# EAGLE design ece_411_team9_bird_feeder (EAGLE 9.6.2)
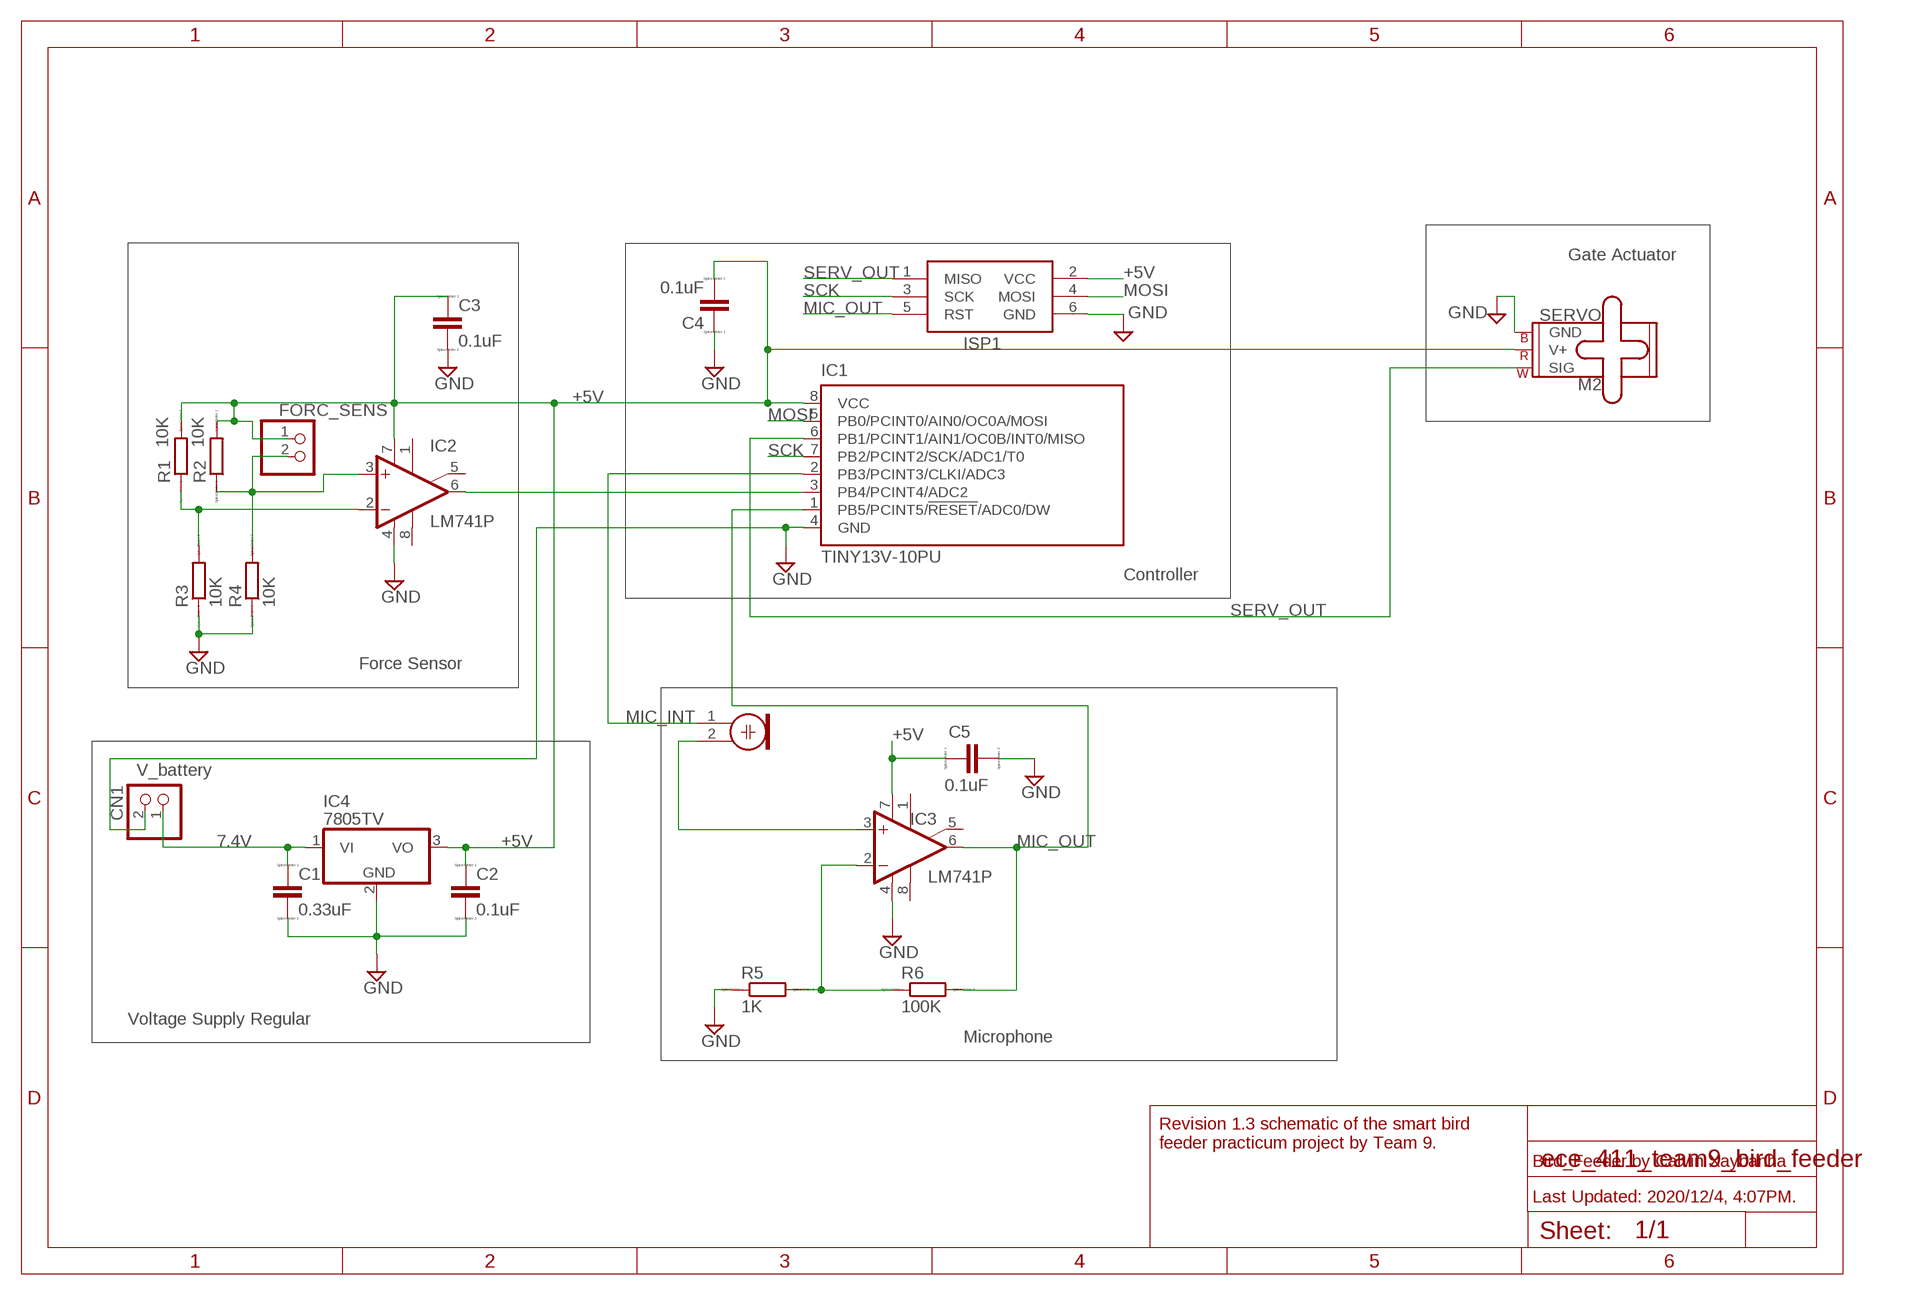
[diagram p0: schematic, sheet 1]

## Parts
C1  0.33uF  C  [C0805]
C2  0.1uF  C  [C0805]
C3  0.1uF  C  [C0805]
C4  0.1uF  C  [C0805]
C5  0.1uF  C  [C0805]
CN1  V_battery  JST_2PIN-SMT  [JST-PH-2-SMT]
FORC_SENS  PINHD-1X2/90  [1X02/90]
IC1  TINY13V-10PU  [DIL08]
IC2  LM741P  [DIL08]
IC3  LM741P  [DIL08]
IC4  7805TV  [TO220V]
ISP1  AVRISP-6  [AVRISP]
M1  ELECTRET_MICROPHON-WM.64PN  [WM-64PN]
M2  SERVO  [1X03]
R1  10K  R  [R0805]
R2  10K  R  [R0805]
R3  10K  R  [R0805]
R4  10K  R  [R0805]
R5  1K  R  [R0805]
R6  100K  R  [R0805]

## Nets
7.4V: C1.1 CN1.1 IC4.1(VI)
+5V [Power]: C2.1 C3.1 C4.2 C5.1 FORC_SENS.1 IC1.8(VCC) IC2.7(V+) IC3.7(V+) IC4.3(VO) ISP1.2(VCC) M2.2(V+) R1.2 R2.2
FSNS_OP2 [Signals]: IC2.2(-IN) R1.1 R3.2
FSNS_OP3 [Signals]: FORC_SENS.2 IC2.3(+IN) R2.1 R4.2
FSNS_OUT [Signals]: IC1.3(PB4/PCINT4/ADC2) IC2.6(OUT)
GND: C1.2 C2.2 C3.2 C4.1 C5.2 CN1.2 IC1.4(GND) IC2.4(V-) IC3.4(V-) IC4.2(GND) ISP1.6(GND) M2.3(GND) R3.1 R4.1 R5.1
MIC_INT [Signals]: IC1.2(PB3/PCINT3/CLKI/ADC3) M1.1
MIC_OP2 [Signals]: IC3.2(-IN) R5.2 R6.1
MIC_OP3 [Signals]: IC3.3(+IN) M1.2
MIC_OUT [Signals]: IC1.1(PB5/PCINT5/!RESET!/ADC0/DW) IC3.6(OUT) ISP1.5(RST) R6.2
MOSI: IC1.5(PB0/PCINT0/AIN0/OC0A/MOSI) ISP1.4(MOSI)
SCK: IC1.7(PB2/PCINT2/SCK/ADC1/T0) ISP1.3(SCK)
SERV_OUT [Signals]: IC1.6(PB1/PCINT1/AIN1/OC0B/INT0/MISO) ISP1.1(MISO) M2.1(SIG)
Unconnected: IC2.1(ON1) IC2.5(ON2) IC2.8(OPT) IC3.1(ON1) IC3.5(ON2) IC3.8(OPT)

## Notes on the sheet
- Gate Actuator
- Controller
- Force Sensor
- Voltage Supply Regular
- Microphone
- Revision 1.3 schematic of the smart bird
  feeder practicum project by Team 9.
- Bird_Feeder by Calvin Xaybanha
- Last Updated: 2020/12/4, 4:07PM.

## Library data of the parts
C1-C5 = eagle-ltspice:C: CAPACITOR, European symbol; SPICEMODEL: NONE; SPICEPREFIX: C
CN1 = adafruit:JST_2PIN: JST 2-Pin Connectors of various flavors SMT-RA (S2B-PH-SM4) 4UConnector #17311 SMT (B2B-PH-SM4) THM-RA (S2B-PH) THM (B2B-PH)
FORC_SENS = pinhead:PINHD-1X2: PIN HEADER
IC1 = atmel:TINY13: 8-bit AVR Microcontroller with 1K Bytes In-System Programmable Flash Source: http://www.atmel.com/dyn/resources/prod_documents/2535S.pdf; MPN: ATTINY13V-10PU; OC_FARNELL: 9171576; OC_NEWARK: 96K6523
IC2 IC3 = linear:*741: OP AMP
IC4 = linear:78*: Positive VOLTAGE REGULATOR Source: http://cache.national.com/ds/LM/LM78L05.pdf http://www.fairchildsemi.com/ds/LM/LM7805.pdf
ISP1 = adafruit:AVRISP: AVR ISP HEADER Standard 6 pin header for AVR programming
M1 = microphon:ELECTRET_MICROPHON-: Electret Condenser Microphone
M2 = SparkFun-Electromechanical:SERVO: Servo Motor 3-pin connector for a standard servo motor (voltage supply, ground, and control signal.) SparkFun Products Servo - Generic (Sub-Micro Size) <https://www.sparkfun.com/products/9065> (ROB-09065) Servo - Generic High Torque Continuous Rotation (Standard Size) <https://www.sparkfun.com/products/9347> (ROB-09347) Servo - Generic High Torque (Standard Size) <https://www.sparkfun.com/products/11965> (ROB-11965)
R1-R6 = eagle-ltspice:R: RESISTOR, European symbol; SPICEMODEL: NONE; SPICEPREFIX: R

## Module CONTROLLER
Ports: 

### Library data of the parts

## Net classes
0 default: width 0.305 mm
1 Power: width 1.27 mm
2 Signals: width 0.305 mm

## Board
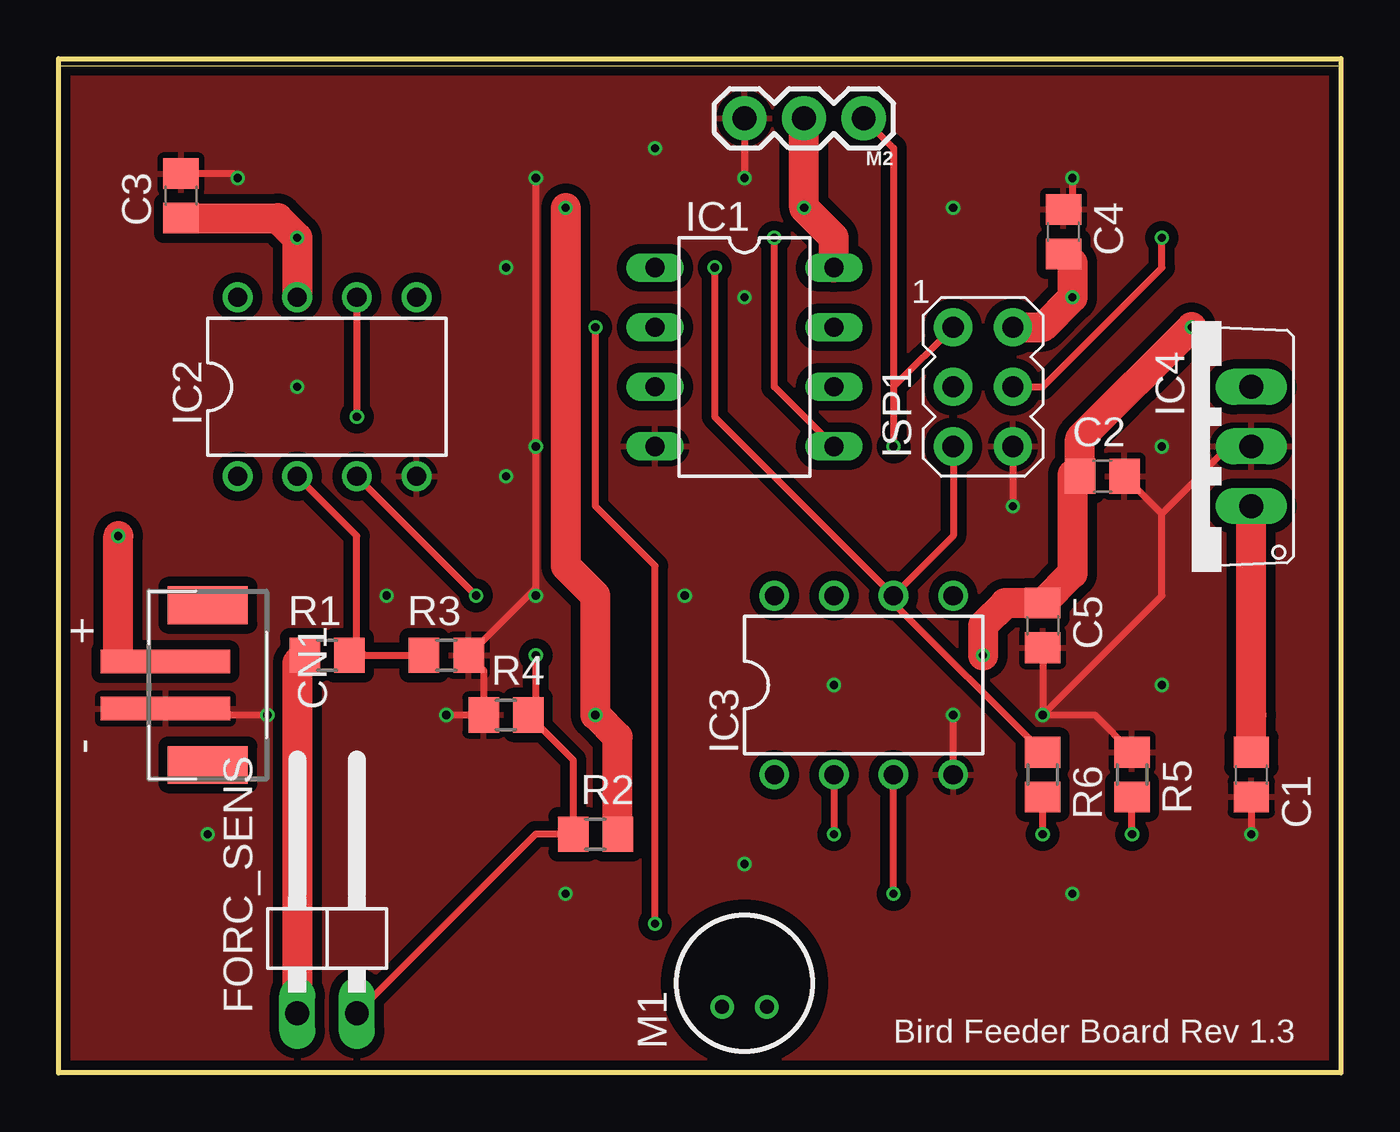
[diagram p1: board, top side]
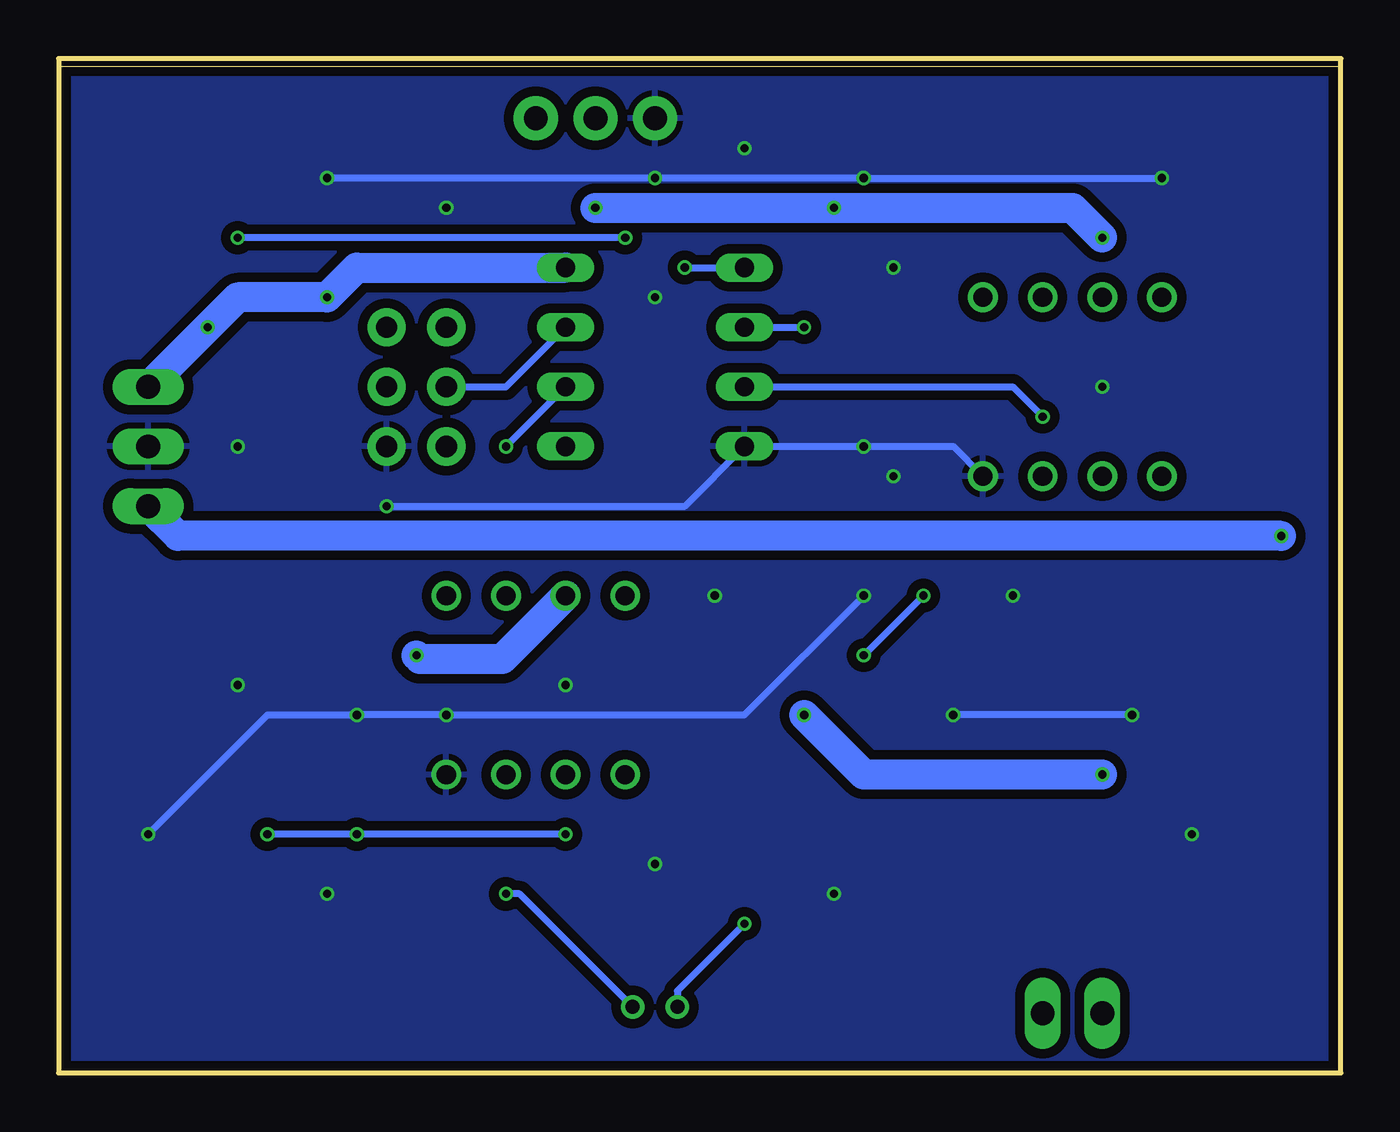
[diagram p2: board, bottom side, seen from below]

Size 54.61 x 43.18 mm. Coordinates in mm from the lower left corner, seen from the top.
Outline: 54.61,0 54.59,0 54.59,42.85 0,42.85 0,43.18
Outline: 0,43.18 0,0 54.61,0
Outline: 0,43.18 54.61,43.18 54.61,0
Copper layers (1*16): Top 0.035559375mm / dielectric 1.6mm / Bottom 0.035559375mm
Design rules "oshpark-2layer": minimum track width 6mil, minimum drill 10mil, track to track 6mil, track to pad 6mil, pad to pad 6mil, via to via 6mil, smd to smd 6mil, copper to edge 15mil, drill to drill 6mil, minimum pad ring 5mil, minimum via ring 5mil, stop-mask expansion 2.5mil, vias tented up to drill 0mil, thermal gap 10mil

### Footprints (pad centres in the part's own frame; a part is rotated, then mirrored left to right if it is on the bottom)
C0805 = smd 1.3 x 1.5: 1 -0.95,0; 2 0.95,0
JST-PH-2-SMT = smd 1 x 5.5: 1 -1,-1.8; 2 1,-1.8 | smd 1.6 x 3.4: NC1 -3.4,0; NC2 3.4,0
1X02/90 = drill 1.016 long: 1 -1.27,-3.81; 2 1.27,-3.81
DIL08 = drill 0.813 long: 1 -3.81,-3.81; 2 -1.27,-3.81; 3 1.27,-3.81; 4 3.81,-3.81; 5 3.81,3.81; 6 1.27,3.81; 7 -1.27,3.81; 8 -3.81,3.81
DIL08' = drill 0.813 pad 1.27: 1 -3.81,-3.81; 2 -1.27,-3.81; 3 1.27,-3.81; 4 3.81,-3.81; 5 3.81,3.81; 6 1.27,3.81; 7 -1.27,3.81; 8 -3.81,3.81
TO220V = drill 1.016 long: 1 -2.54,-2.54; 2 0,-2.54; 3 2.54,-2.54
AVRISP = drill 0.9 pad 1.626: 1 -1.27,2.54; 2 1.27,2.54; 3 -1.27,0; 4 1.27,0; 5 -1.27,-2.54; 6 1.27,-2.54
WM-64PN = drill 0.6 pad 1: 1 -1,0.95; 2 -1,-0.95
1X03 = drill 1.016 pad 1.88: 1 0,0; 2 2.54,0; 3 5.08,0
R0805 = smd 1.3 x 1.5: 1 -0.95,0; 2 0.95,0

### Placement (x,y rotation side)
C1  50.8,12.7 270 top
C2  44.45,25.4 0 top
C3  5.21,37.34 90 top
C4  42.8,35.81 270 top
C5  41.91,19.05 270 top
CN1  6.35,16.51 270 top
FORC_SENS  11.43,6.35 0 top
IC1  29.21,30.48 270 top
IC2  LM741P  [DIL08']  11.43,29.21 0 top
IC3  LM741P  [DIL08']  34.29,16.51 0 top
IC4  48.26,26.67 90 top
ISP1  39.37,29.21 0 top
M1  29.21,3.81 90 top
M2  34.29,40.64 180 top
R1  11.43,17.78 180 top
R2  22.86,10.16 0 top
R3  16.51,17.78 180 top
R4  19.05,15.24 0 top
R5  45.72,12.7 270 top
R6  41.91,12.7 90 top

### Tracks (layer width: path | path; a pad name or v marks a point on that pad's centre or on a via)
7.4V  (via drill 0.35)
  Top 0.305: CN1.1 2.81,17.51 2.54,17.78
  Top 1.27: 2.54,17.78 v2.54,22.86 | C1.1 50.8,15.24 IC4.1
  Bottom 1.27: IC4.1 49.53,22.86 v2.54,22.86
+5V  (via drill 0.35)
  Top 1.27: C4.2 43.18,34.48 v43.18,33.02 41.91,31.75 ISP1.2 | v21.59,36.83 21.59,21.59 22.86,20.32 v22.86,15.24 23.81,14.29 R2.2 | R1.2 10.16,17.46 v10.16,12.7 FORC_SENS.1 | v39.37,17.78 39.37,19.05 40.32,20 C5.1 43.18,21.27 43.18,25.48 C2.1 43.5,26.99 v48.26,31.75 | C3.1 9.33,36.39 v10.16,35.56 IC2.7 | M2.2 v31.75,36.83 33.02,35.56 IC1.8
  Bottom 1.27: v31.75,36.83 v21.59,36.83 11.43,36.83 v10.16,35.56 | v39.37,17.78 39.22,17.63 35.71,17.63 IC3.7 | IC1.8 41.91,34.29 v43.18,33.02 46.99,33.02 v48.26,31.75 IC4.3 | v10.16,12.7 20.32,12.7 v22.86,15.24
FSNS_OP2
  Top 0.305: IC2.2 12.7,22.86 12.7,18.1 | 12.7,18.1 13.02,17.78 R3.2 | R1.1 12.7,18.1
FSNS_OP3  (via drill 0.35)
  Top 0.305: IC2.3 v17.78,20.32 | v20.32,17.78 20.32,15.56 R4.2 21.91,13.33 R2.1 20.32,10.16 FORC_SENS.2
  Bottom 0.305: v17.78,20.32 v20.32,17.78
FSNS_OUT  (via drill 0.35)
  Top 0.305: IC2.6 v12.7,27.94
  Bottom 0.305: IC1.3 13.97,29.21 v12.7,27.94
GND  (via drill 0.35)
  Top 0.305: IC3.4 v38.1,15.24 | 20.32,20.64 v20.32,26.67 v20.32,38.1 | 20.32,20.64 v20.32,20.32 | M2.3 v29.21,38.1 | v43.18,38.1 43.18,37.15 C4.1 | v7.62,38.1 7.43,38.29 C3.2 | C5.2 v41.91,15.24 | v41.91,15.24 46.99,20.32 46.99,23.81 | 45.58,25.26 C2.2 46.99,23.81 | C1.2 v50.8,10.16 | 20.32,20.64 R3.1 18.1,17.14 R4.1 v16.51,15.24 | v8.89,15.24 6.35,15.24 6.08,15.51 CN1.2 | v41.91,15.24 44.13,15.24 R5.1 | ISP1.6 v40.64,24.13 | 46.99,23.81 49.85,26.67 IC4.2
  Bottom 0.305: IC2.4 16.51,26.67 v20.32,26.67 IC1.4 27.94,24.13 v40.64,24.13 | v43.18,38.1 v29.21,38.1 v20.32,38.1 v7.62,38.1 | v50.8,10.16 45.72,15.24 v41.91,15.24 v38.1,15.24 25.4,15.24 v20.32,20.32 | v8.89,15.24 v16.51,15.24
  other vias: 6.35,10.16 21.59,7.62 29.21,8.89 43.18,7.62 19.05,25.4 46.99,16.51 33.02,16.51 19.05,34.29 10.16,29.21 46.99,26.67 29.21,33.02 13.97,20.32 38.1,36.83 25.4,39.37 26.67,20.32
  pour Bottom (isolate 0.406, rank 2): 0,43.18 54.61,43.18 54.61,0 0,0
  pour Top (isolate 0.406): 0,0 0,43.18 54.61,43.18 54.61,0
MIC_INT  (via drill 0.35)
  Top 0.305: v25.4,6.35 25.4,21.59 22.86,24.13 v22.86,31.75
  Bottom 0.305: IC1.2 v22.86,31.75 | v25.4,6.35 28.26,3.49 M1.1
MIC_OP2  (via drill 0.35)
  Top 0.305: IC3.2 v33.02,10.16 | v41.91,10.16 R6.1 | v45.72,10.16 R5.2
  Bottom 0.305: v33.02,10.16 v41.91,10.16 v45.72,10.16
MIC_OP3  (via drill 0.35)
  Top 0.305: v35.56,7.62 IC3.3
  Bottom 0.305: M1.2 34.97,7.62 v35.56,7.62
MIC_OUT  (via drill 0.35)
  Top 0.305: R6.2 35.56,20 IC3.6 | v27.94,34.29 27.94,27.94 IC3.6 | ISP1.5 38.1,22.86 IC3.6
  Bottom 0.305: v27.94,34.29 IC1.1
MOSI  (via drill 0.35)
  Top 0.305: IC1.5 30.48,29.21 v30.48,35.56 | ISP1.4 41.91,29.21 46.99,34.29 v46.99,35.56
  Bottom 0.305: v30.48,35.56 v46.99,35.56
SCK
  Bottom 0.305: ISP1.3 35.56,29.21 IC1.7
SERV_OUT  (via drill 0.35)
  Top 0.305: 35.56,29.21 35.56,39.37 M2.1 | 35.56,29.21 v35.56,26.67 | ISP1.1 35.56,29.21
  Bottom 0.305: v35.56,26.67 IC1.6

### Text on the board
tNames: Bird Feeder Board Rev 1.3
tValues: V_BATT | GND